# EAGLE design indicator (EAGLE 7.4.0)
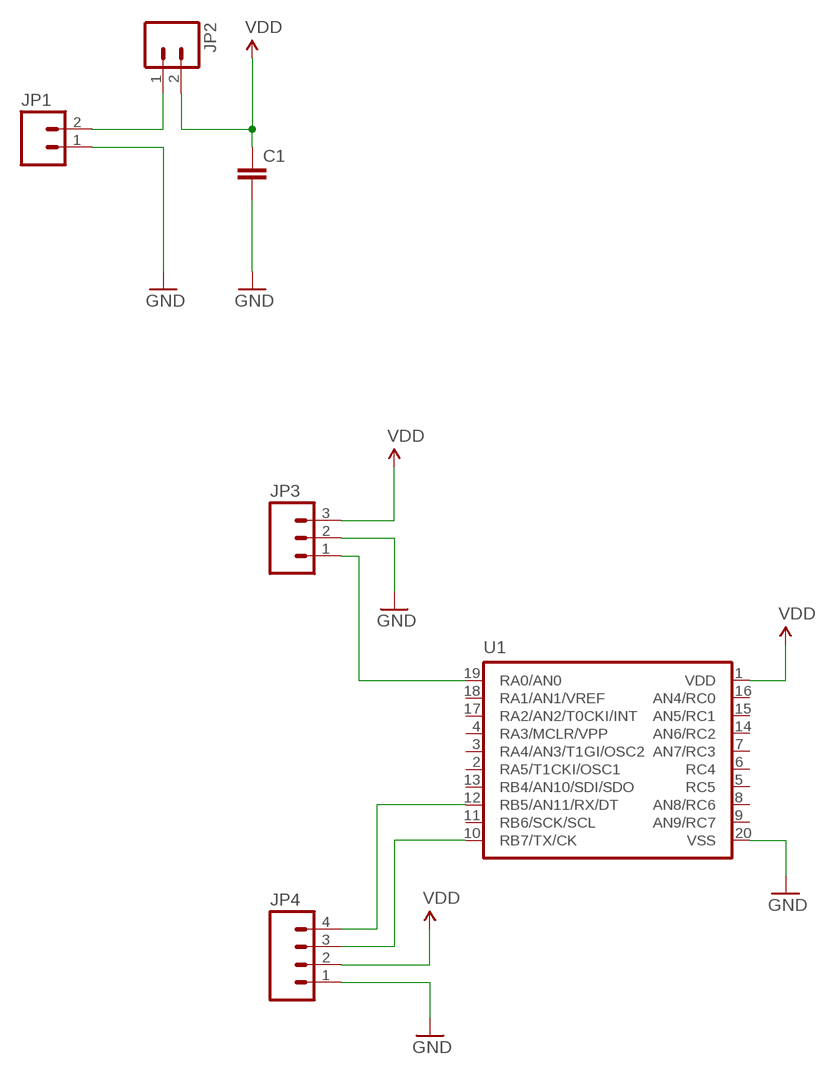
[diagram p0: schematic, sheet 1]

## Parts
C1  CAPPTH1  [CAP-PTH-5MM]
JP1  M02PTH  [1X02]
JP2  M02PTH  [1X02]
JP3  M03PTH  [1X03]
JP4  M04PTH  [1X04]
U1  PIC16F6XX  [DIL20]

## Nets
GND: C1.2 JP1.1 JP3.2 JP4.1 U1.20(VSS)
N$1: JP1.2 JP2.1
N$2: JP3.1 U1.19(RA0/AN0)
N$3: JP4.4 U1.12(RB5/AN11/RX/DT)
N$4: JP4.3 U1.10(RB7/TX/CK)
VDD: C1.1 JP2.2 JP3.3 JP4.2 U1.1(VDD)
Unconnected: U1.2(RA5/T1CKI/OSC1) U1.3(RA4/AN3/T1GI/OSC2) U1.4(RA3/MCLR/VPP) U1.5(RC5) U1.6(RC4) U1.7(AN7/RC3) U1.8(AN8/RC6) U1.9(AN9/RC7) U1.11(RB6/SCK/SCL) U1.13(RB4/AN10/SDI/SDO) U1.14(AN6/RC2) U1.15(AN5/RC1) U1.16(AN4/RC0) U1.17(RA2/AN2/T0CKI/INT) U1.18(RA1/AN1/VREF)

## Library data of the parts
C1 = SparkFun-Capacitors:CAP: Capacitor Standard 0603 ceramic capacitor, and 0.1" leaded capacitor.
JP1 JP2 = SparkFun-Connectors:M02: Standard 2-pin 0.1" header. Use with - straight break away headers ( PRT-00116) - right angle break away headers (PRT-00553) - swiss pins (PRT-00743) - machine pins (PRT-00117) - female headers (PRT-00115) Molex polarized connector foot print use with: PRT-08233 with associated crimp pins and housings. 2.54_SCREWTERM for use with PRT-10571. 3.5mm Screw Terminal footprints for PRT-08084 5mm Screw Terminal footprints for use with PRT-08432
JP3 = SparkFun-Connectors:M03: Header 3 Standard 3-pin 0.1" header. Use with straight break away headers (SKU : PRT-00116), right angle break away headers (PRT-00553), swiss pins (PRT-00743), machine pins (PRT-00117), and female headers (PRT-00115). Molex polarized connector foot print use with SKU : PRT-08232 with associated crimp pins and housings.
JP4 = SparkFun-Connectors:M04: Header 4 Standard 4-pin 0.1" header. Use with straight break away headers (SKU : PRT-00116), right angle break away headers (PRT-00553), swiss pins (PRT-00743), machine pins (PRT-00117), and female headers (PRT-00115). Molex polarized connector foot print use with SKU : PRT-08231 with associated crimp pins and housings. 1MM SMD Version SKU: PRT-10208
U1 = pic16f690:PIC16F6XX

## Board
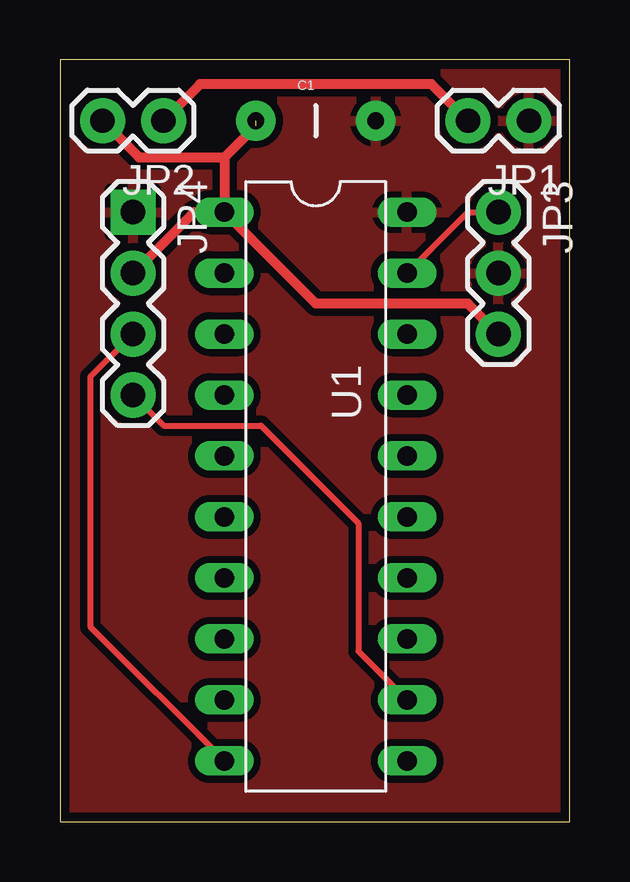
[diagram p1: board, top side]

Size 21.26 x 31.74 mm. Coordinates in mm from the lower left corner, seen from the top.
Outline: 0,0 21.26,0 21.26,31.74 0,31.74 0,0
Copper layers (1*16): Top 0.0356mm / dielectric 1.5011mm / Bottom 0.0356mm
Design rules "LaenPCBOrder": minimum track width 6mil, minimum drill 13mil, track to track 6mil, track to pad 6mil, pad to pad 6mil, via to via 6mil, smd to smd 6mil, copper to edge 15mil, drill to drill 6mil, minimum pad ring 7mil, minimum via ring 7mil, stop-mask expansion 3mil, vias tented up to drill 0mil, thermal gap 10mil

### Footprints (pad centres in the part's own frame; a part is rotated, then mirrored left to right if it is on the bottom)
CAP-PTH-5MM = drill 0.7 pad 1.651: 1 -2.5,0; 2 2.5,0
1X02 = drill 1.016 pad 1.88: 1 0,0; 2 2.54,0
1X03 = drill 1.016 pad 1.88: 1 0,0; 2 2.54,0; 3 5.08,0
1X04 = drill 1.016 pad 1.88 square: 1 0,0 | drill 1.016 pad 1.88: 2 2.54,0; 3 5.08,0; 4 7.62,0
DIL20 = drill 0.813 long: 1 -11.43,-3.81; 2 -8.89,-3.81; 3 -6.35,-3.81; 4 -3.81,-3.81; 5 -1.27,-3.81; 6 1.27,-3.81; 7 3.81,-3.81; 8 6.35,-3.81; 9 8.89,-3.81; 10 11.43,-3.81; 11 11.43,3.81; 12 8.89,3.81; 13 6.35,3.81; 14 3.81,3.81; 15 1.27,3.81; 16 -1.27,3.81; 17 -3.81,3.81; 18 -6.35,3.81; 19 -8.89,3.81; 20 -11.43,3.81

### Placement (x,y rotation side)
C1  10.67,29.21 0 top
JP1  19.56,29.21 180 top
JP2  4.32,29.21 180 top
JP3  18.29,25.4 270 top
JP4  3.05,25.4 270 top
U1  10.67,13.97 270 top

### Tracks (layer width: path | path; a pad name or v marks a point on that pad's centre or on a via)
GND
  Top 0.406: JP4.1 2.54,25.4
  pour Top (isolate 0.305): 0,0 0,31.75 21.34,31.75 21.34,31.5 21.34,0
N$1
  Top 0.406: JP1.2 15.49,30.73 5.84,30.73 JP2.1
N$2
  Top 0.254: U1.19 17.02,25.4 JP3.1
N$3
  Top 0.254: JP4.4 4.32,16.51 8.38,16.51 12.45,12.45 12.45,7.11 U1.12
N$4
  Top 0.254: JP4.3 1.27,18.54 1.27,8.13 U1.10
VDD  (1 unrouted)
  Top 0.406: 6.86,27.69 3.3,27.69 JP2.2 | 6.86,27.69 8.17,29 | 6.86,27.69 U1.1 | JP3.3 17.02,21.59 10.67,21.59 U1.1 | JP4.2 5.59,25.4 U1.1